# Altium schematic sheet Carte_design_SCH.SchDoc: STM32_DEVBOARD
size A4; Revision: 1
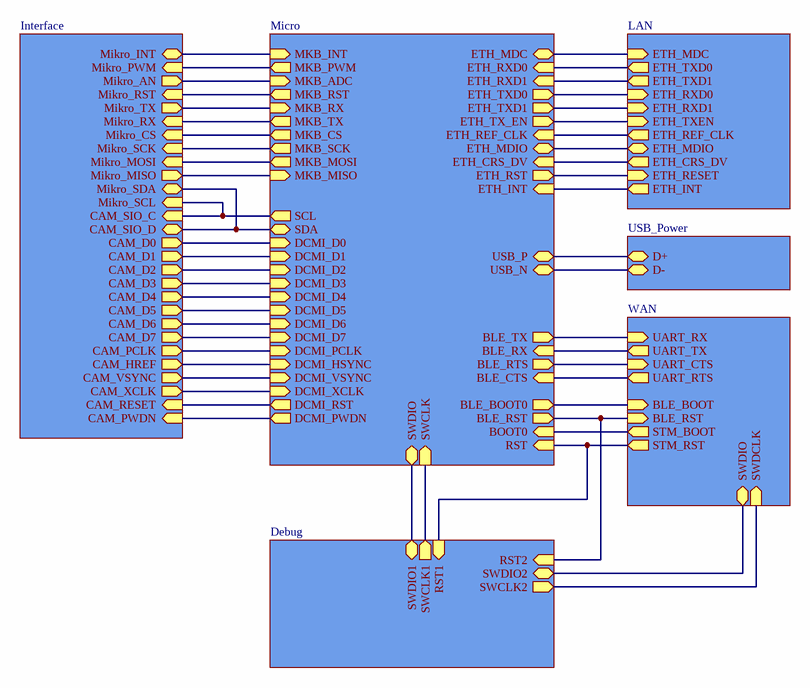
[diagram p0: Carte_design_SCH.SchDoc]

## Sub-sheets
Debug = Debug.SchDoc: SWDIO2 (bidir), SWDIO1 (bidir), SWCLK1 (out), SWCLK2 (out), RST2 (in), RST1 (in)
Interface = Interface.SchDoc: Mikro_INT (bidir), Mikro_TX (out), Mikro_PWM (in), Mikro_AN (out), Mikro_SDA (bidir), Mikro_MISO (out), Mikro_RST (in), Mikro_SCL (in), Mikro_SCK (in), Mikro_MOSI (in), Mikro_CS (in), Mikro_RX (in), CAM_D6 (out), CAM_PCLK (out), CAM_D3 (out), CAM_RESET (in), CAM_D4 (out), CAM_SIO_C (in), CAM_D7 (out), CAM_D1 (out), CAM_D0 (out), CAM_SIO_D (bidir), CAM_HREF (out), CAM_D5 (out), CAM_VSYNC (out), CAM_D2 (out), CAM_PWDN (in), CAM_XCLK (out)
LAN = LAN.SchDoc: ETH_INT (out), ETH_MDC (in), ETH_REF_CLK (out), ETH_TXEN (in), ETH_MDIO (bidir), ETH_CRS_DV (out), ETH_RESET (in), ETH_TXD0 (out), ETH_TXD1 (out), ETH_RXD0 (in), ETH_RXD1 (in)
Micro = Micro.SchDoc: USB_N (bidir), DCMI_VSYNC (in), DCMI_D1 (in), DCMI_XCLK (in), SDA (bidir), BLE_RX (in), SWDIO (bidir), MKB_MOSI (out), MKB_RX (in), MKB_RST (out), ETH_MDC (bidir), ETH_RXD0 (in), DCMI_PWDN (out), ETH_MDIO (bidir), DCMI_D3 (in), DCMI_HSYNC (in), USB_P (bidir), DCMI_D2 (in), DCMI_D4 (in), BLE_RST (out), ETH_TXD0 (out), ETH_TXD1 (out), MKB_PWM (out), BLE_CTS (in), MKB_CS (out), ETH_TX_EN (out), DCMI_D6 (in), SWCLK (in), DCMI_D5 (in), DCMI_PCLK (in), SCL (out), MKB_SCK (out), ETH_RXD1 (in), DCMI_D0 (in), DCMI_D7 (in), DCMI_RST (out), MKB_MISO (in), BLE_BOOT0 (out), MKB_INT (in), BLE_TX (out), ETH_RST (out), MKB_TX (out), RST (in), MKB_ADC (in), BLE_RTS (out), BOOT0 (in), ETH_CRS_DV (in), ETH_REF_CLK (in), ETH_INT (in)
USB_Power = USB_Power.SchDoc: D+ (bidir), D- (bidir)
WAN = WAN.SchDoc: UART_RX (in), STM_RST (out), UART_TX (out), UART_CTS (in), BLE_BOOT (in), SWDIO (bidir), BLE_RST (in), UART_RTS (out), SWDCLK (in), STM_BOOT (out)

## Nets
(unnamed): sheet Interface/Mikro_INT, sheet Micro/MKB_INT
(unnamed): sheet Interface/Mikro_TX, sheet Micro/MKB_RX
(unnamed): sheet Interface/Mikro_PWM, sheet Micro/MKB_PWM
(unnamed): sheet Interface/Mikro_AN, sheet Micro/MKB_ADC
(unnamed): sheet Interface/Mikro_SDA, sheet Interface/CAM_SIO_D, sheet Micro/SDA
(unnamed): sheet Interface/Mikro_MISO, sheet Micro/MKB_MISO
(unnamed): sheet Interface/Mikro_RST, sheet Micro/MKB_RST
(unnamed): sheet Interface/Mikro_SCL, sheet Interface/CAM_SIO_C, sheet Micro/SCL
(unnamed): sheet Interface/Mikro_SCK, sheet Micro/MKB_SCK
(unnamed): sheet Interface/Mikro_MOSI, sheet Micro/MKB_MOSI
(unnamed): sheet Interface/Mikro_CS, sheet Micro/MKB_CS
(unnamed): sheet Interface/Mikro_RX, sheet Micro/MKB_TX
(unnamed): sheet Interface/CAM_D6, sheet Micro/DCMI_D6
(unnamed): sheet Interface/CAM_PCLK, sheet Micro/DCMI_PCLK
(unnamed): sheet Interface/CAM_D3, sheet Micro/DCMI_D3
(unnamed): sheet Interface/CAM_RESET, sheet Micro/DCMI_RST
(unnamed): sheet Interface/CAM_D4, sheet Micro/DCMI_D4
(unnamed): sheet Interface/CAM_D7, sheet Micro/DCMI_D7
(unnamed): sheet Interface/CAM_D1, sheet Micro/DCMI_D1
(unnamed): sheet Interface/CAM_D0, sheet Micro/DCMI_D0
(unnamed): sheet Interface/CAM_HREF, sheet Micro/DCMI_HSYNC
(unnamed): sheet Interface/CAM_D5, sheet Micro/DCMI_D5
(unnamed): sheet Interface/CAM_VSYNC, sheet Micro/DCMI_VSYNC
(unnamed): sheet Interface/CAM_D2, sheet Micro/DCMI_D2
(unnamed): sheet Interface/CAM_PWDN, sheet Micro/DCMI_PWDN
(unnamed): sheet Interface/CAM_XCLK, sheet Micro/DCMI_XCLK
(unnamed): sheet USB_Power/D+, sheet Micro/USB_P
(unnamed): sheet USB_Power/D-, sheet Micro/USB_N
(unnamed): sheet LAN/ETH_INT, sheet Micro/ETH_INT
(unnamed): sheet LAN/ETH_MDC, sheet Micro/ETH_MDC
(unnamed): sheet LAN/ETH_REF_CLK, sheet Micro/ETH_REF_CLK
(unnamed): sheet LAN/ETH_TXEN, sheet Micro/ETH_TX_EN
(unnamed): sheet LAN/ETH_MDIO, sheet Micro/ETH_MDIO
(unnamed): sheet LAN/ETH_CRS_DV, sheet Micro/ETH_CRS_DV
(unnamed): sheet LAN/ETH_RESET, sheet Micro/ETH_RST
(unnamed): sheet LAN/ETH_TXD0, sheet Micro/ETH_RXD0
(unnamed): sheet LAN/ETH_TXD1, sheet Micro/ETH_RXD1
(unnamed): sheet LAN/ETH_RXD0, sheet Micro/ETH_TXD0
(unnamed): sheet LAN/ETH_RXD1, sheet Micro/ETH_TXD1
(unnamed): sheet WAN/UART_RX, sheet Micro/BLE_TX
(unnamed): sheet WAN/STM_RST, sheet Micro/RST, sheet Debug/RST1
(unnamed): sheet WAN/UART_TX, sheet Micro/BLE_RX
(unnamed): sheet WAN/UART_CTS, sheet Micro/BLE_RTS
(unnamed): sheet WAN/BLE_BOOT, sheet Micro/BLE_BOOT0
(unnamed): sheet WAN/SWDIO, sheet Debug/SWDIO2
(unnamed): sheet WAN/BLE_RST, sheet Micro/BLE_RST, sheet Debug/RST2
(unnamed): sheet WAN/UART_RTS, sheet Micro/BLE_CTS
(unnamed): sheet WAN/SWDCLK, sheet Debug/SWCLK2
(unnamed): sheet WAN/STM_BOOT, sheet Micro/BOOT0
(unnamed): sheet Micro/SWDIO, sheet Debug/SWDIO1
(unnamed): sheet Micro/SWCLK, sheet Debug/SWCLK1